# Altium schematic sheet OpenMEA_power.SchDoc
size A4
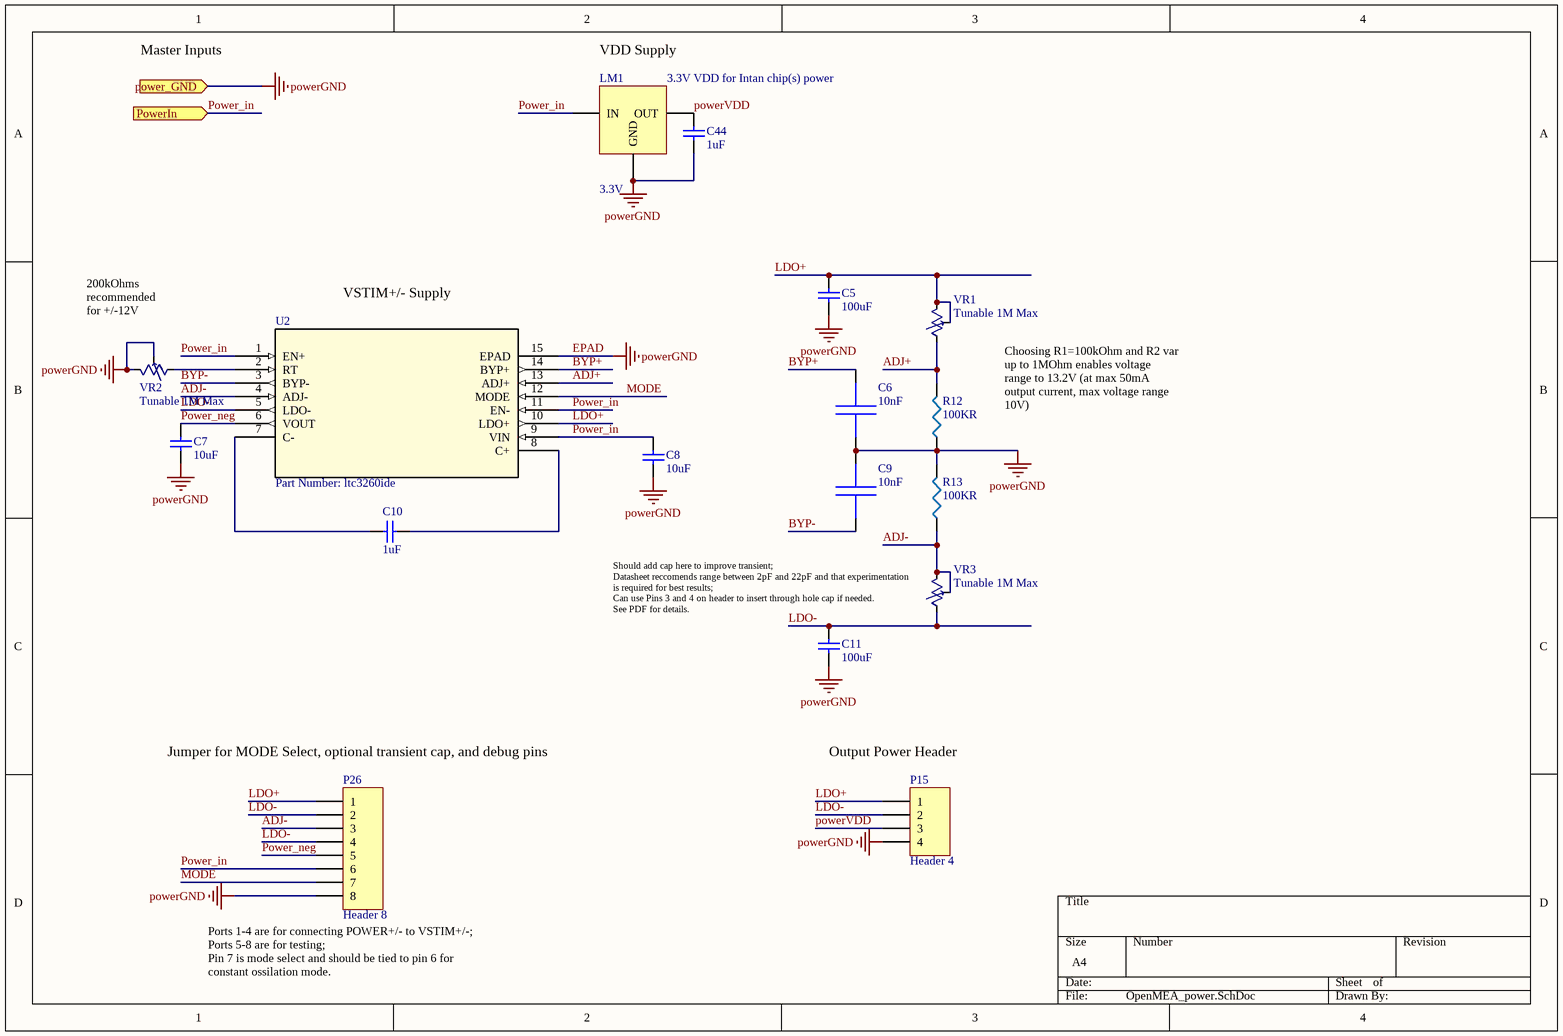
[diagram p0: OpenMEA_power.SchDoc]

## Parts
C5  100uF  [CAP_EEFK_D]
C6  value 10nF  [rcl_0402i_1005m_nominal]  (hidden comment: capacitor_npol_ame)
C7  10uF  [C0805]
C8  10uF  [C0805]
C9  value 10nF  [rcl_0402i_1005m_nominal]  (hidden comment: capacitor_npol_ame)
C10  1uF  [C0805]
C11  100uF  [CAP_EEFK_D]
C44  1uF  [C0805]
LM1  3.3V  [LM1085]
P15  Header 4  [OSTVN04A150]
P26  Header 8  [TE_5-535541-6]
R12  100KR  [R0805]
R13  100KR  [R0805]
U2  Part Number: ltc3260ide  [DFN-14_DE]
VR1  Tunable 1M Max  [res_var_5turn]
VR2  Tunable 1M Max  [res_var_5turn]
VR3  Tunable 1M Max  [res_var_5turn]

## Ports
power_GND (in), PowerIn (in)

## Nets
EPAD: C5.1 C6.1 C7.1 C8.1 C9.1 C11.1 C44.1 LM1.1(GND) P15.4 P26.8 R12.1 R13.2 U2.15(EPAD) VR2.1 VR2.2 ; port power_GND  [also labelled powerGND]
ADJ+: R12.2 U2.13(ADJ+) VR1.3
ADJ-: P26.3 R13.1 U2.4(ADJ-) VR3.1 VR3.2
BYP+: C6.2 U2.14(BYP+)
BYP-: C9.2 U2.3(BYP-)
LDO+: C5.2 P15.1 P26.1 U2.10(LDO+) VR1.1 VR1.2
LDO-: C11.2 P15.2 P26.2 P26.4 U2.5(LDO-) VR3.3
MODE: P26.7 U2.12(MODE)
Power_in: C8.2 LM1.3(IN) P26.6 U2.1(EN+) U2.9(VIN) U2.11(EN-) ; port PowerIn
Power_neg: C7.2 P26.5 U2.6(VOUT)
powerVDD: C44.2 LM1.2(OUT) P15.3
NetC10_1: C10.1 U2.8(C+)
NetC10_2: C10.2 U2.7(C-)
NetU2_2: U2.2(RT) VR2.3

## Notes on the sheet
- Master Inputs
- VDD Supply
- 3.3V VDD for Intan chip(s) power
- VSTIM+/- Supply
- (near VR2) 200kOhms recommended for +/-12V
- Choosing R1=100kOhm and R2 var up to 1MOhm enables voltage range to 13.2V (at max 50mA output current, max voltage range 10V)
- Should add cap here to improve transient;
  Datasheet reccomends range between 2pF and 22pF and that experimentation is required for best results;
  Can use Pins 3 and 4 on header to insert through hole cap if needed.
  See PDF for details.
- (near P26) Jumper for MODE Select, optional transient cap, and debug pins
- (near P15) Output Power Header
- (near P26) Ports 1-4 are for connecting POWER+/- to VSTIM+/-;
  Ports 5-8 are for testing;
  Pin 7 is mode select and should be tied to pin 6 for constant ossilation mode.

## Library data of the parts
C5 C11 = C2012X5R1E106K085AC: CAP ALUM 100UF 20% 35V SMD; Manufacturer: Panasonic Electronic Components; Manufacturer Part Number: EEE-FT1V101AP; Dielectric: Electrolytic Capacitor; Diam.: 6.3mm; Polarization: Polarized; ESR (Equivalent Series Resistance): 260mOhm @ 100kHz; Ripple Current @ Low Frequency: 195mA @ 120Hz; Ripple Current @ High Frequency: 300mA @ 100kHz; Supplier 1: Digi-Key; Stock 1: 336,289; Pricing 1: 1=0.86;  10=0.605;  100=0.3984  (CAD); Mount: Surface Mount; Dielectric Material: N/A; Min Operating Temperature: -55°C; Max Operating Temperature: 105°C; Packaging: Cut Tape (CT); Capacitance: 100uF; Tolerance: 20%; Voltage Rating: 35V; Termination: SMD/SMT; Voltage Rating (DC): 35V; Supplier Part Number 1: PCE5016CT-ND; Supplier Link 1: https://www.digikey.ca/product-detail/en/panasonic-electronic-components/EEE-FT1V101AP/PCE5016CT-ND/2652071; Length: 6.6mm; Width: 6.6mm; Height: 6.1mm; Package Type: Radial Can, SMT; ComponentLink1URL: https://industrial.panasonic.com/cdbs/www-data/pdf/RDE0000/ABA0000C1240.pdf; ComponentLink1Description: Datasheet; ComponentLink2URL: https://industrial.panasonic.com/cdbs/www-data/pdf/RDE0000/DME0000COL90.pdf; ComponentLink2Description: NamingScheme
C6 C9 = capacitor_npol_ame: Capacitor Non-polarized American Symbol; Manufacturer: Murata Electronics North America; Manufacturer Part Number: GRM155R71E103KA01D; Voltage Rating: 25V; Tolerance: 10%; Case Code: 0402; Supplier 1: Digikey; Supplier Part Number 1: 490-1312-1-ND; Supplier Link 1: https://www.digikey.ca/products/en?keywords=490-1312-1-ND; Stock 1: 4961; Pricing 1: 1=0.14;  10=0.042;  100=0.0188;  500=0.01346;  1000=0.01058;  3500=0.00961;  5000=0.00884  (CAD); ComponentLink1URL: https://search.murata.co.jp/Ceramy/image/img/A01X/G101/ENG/GRM155R71E103KA01-01.pdf; ComponentLink1Description: Reference Sheet
C7 C8 = C2012X5R1E106K085AC: CAP 10UF; Manufacturer: Samsung Electro-Mechanics; Manufacturer Part Number: CL21A106KAYNNNE; Dielectric Material: Ceramic; Tolerance: 10%; Voltage Rating: 25V; Dielectric: X5R; Supplier 1: Digi-Key; Stock 1: 843; Pricing 1: 1=0.39;  10=0.264;  100=0.13340;  500=0.09128;  1000=0.08075  (CAD); Mount: Surface Mount; Case/Package: 0805; Case Code (Metric): 2012; Case Code (Imperial): 0805; Min Operating Temperature: -55°C; Max Operating Temperature: 85°C; Packaging: Tape and Reel; Capacitance: 10uF; Termination: SMD/SMT; Voltage Rating (DC): 25V; Length: 0.079inch; Width: 0.049inch; Thickness: 1.25mm; Lead Free: Lead Free; ComponentLink1URL: http://www.samsungsem.com/kr/support/product-search/mlcc/__icsFiles/afieldfile/2018/06/20/CL21A106KAYNNNE.pdf; ComponentLink1Description: Specifications; ComponentLink2URL: https://media.digikey.com/pdf/Data%20Sheets/Samsung%20PDFs/CL21A106KAYNNNE_Char.pdf; ComponentLink2Description: Characteristics; ComponentLink3URL: https://media.digikey.com/pdf/Data%20Sheets/Samsung%20PDFs/CL_Series_MLCC_ds.pdf; ComponentLink3Description: Datasheet; Supplier Part Number 1: 1276-2891-1-ND; Supplier Link 1: https://www.digikey.ca/product-detail/en/samsung-electro-mechanics/CL21A106KAYNNNE/1276-2891-1-ND/3890977
C10 C44 = C2012X5R1E105K125AA: CAP 1UF; Manufacturer: TDK; Dielectric Material: Ceramic; Tolerance: 10%; Voltage Rating: 25V; Dielectric: X5R; Supplier 1: Digi-Key; Manufacturer Part Number: C2012X5R1E105K125AA; Stock 1: 517560; Pricing 1: 1=0.21, 10=0.146, 100=0.0688, 500=0.0482, 1000=0.0399 (USD); Mount: Surface Mount; Case/Package: 0805; Number of Pins: 2; Weight: 0.000194oz; Case Code (Metric): 2012; Case Code (Imperial): 0805; Min Operating Temperature: -55°C; Max Operating Temperature: 85°C; Package Quantity: 2000; Capacitance: 1uF; Packaging: Tape and Reel; Voltage Rating (DC): 25V; Termination: SMD/SMT; Composition: Ceramic; Voltage: 25V; Length: 2mm; Height: 1.25mm; Width: 0.049inch; Thickness: 0.057inch; Depth: 1.25mm; Radiation Hardening: No; REACH SVHC: No SVHC; Lead Free: Lead Free; ComponentLink1URL: https://datasheet.ciiva.com/11787/0900766b80c1bb00-11787608.pdf; ComponentLink1Description: https://datasheet.ciiva.com/11787/0900766b80c1bb00-11787608.pdf; ComponentLink2URL: https://datasheet.ciiva.com/24218/c2012x5r1e105k125aa-264807-24218920.pdf; ComponentLink2Description: https://datasheet.ciiva.com/24218/c2012x5r1e105k125aa-264807-24218920.pdf; ComponentLink3URL: https://datasheet.ciiva.com/16449/e412-c-16449595.pdf; ComponentLink3Description: https://datasheet.ciiva.com/16449/e412-c-16449595.pdf; ComponentLink4URL: https://datasheet.ciiva.com/28602/1744655-28602171.pdf; ComponentLink4Description: https://datasheet.ciiva.com/28602/1744655-28602171.pdf; ComponentLink5URL: https://datasheet.ciiva.com/15192/getdatasheetpartid-726707-15192140.pdf; ComponentLink5Description: https://datasheet.ciiva.com/15192/getdatasheetpartid-726707-15192140.pdf; Supplier Part Number 1: 445-1419-1-ND; Supplier Link 1: https://www.digikey.ca/products/en?keywords=445-1419-1-ND
LM1 = LM1085: LM1085ISX-3.3/NOPB; Manufacturer: TI National Semiconductor; Number of Outputs: 1; Min Input Voltage: 2.6V; Max Input Voltage: 27V; Max Output Current: 3A; Polarity: Positive; Quiescent Current: 10mA; Dropout Voltage: 1.3V; Min Current Limit: 3.2A; Supplier 1: Digi-Key; Manufacturer Part Number: LM1085ISX-3.3/NOPB; Stock 1: 18956; Pricing 1: 1=2.03, 10=1.826, 100=1.4677 (USD); Mount: Surface Mount; Case/Package: TO-263; Number of Pins: 3; Contact Plating: Tin,Matte; Min Operating Temperature: -40°C; Max Operating Temperature: 125°C; Output Voltage: 3.3V; Nominal Output Voltage: 3.3V; Output Current: 3A; Packaging: Tape and Reel; Package Quantity: 500; Number of Regulators: 1; Length: 10.16mm; Height: 4.57mm; Width: 8.64mm; Radiation Hardening: No; REACH SVHC: No SVHC; Lead Free: Contains Lead; ComponentLink1URL: https://datasheet.ciiva.com/15111/getdatasheetpartid-55637-15111252.pdf; ComponentLink1Description: https://datasheet.ciiva.com/15111/getdatasheetpartid-55637-15111252.pdf; ComponentLink2URL: https://datasheet.ciiva.com/26167/lm1085-26167653.pdf; ComponentLink2Description: https://datasheet.ciiva.com/26167/lm1085-26167653.pdf; ComponentLink3URL: https://datasheet.ciiva.com/3223/lm1085-3223480.pdf; ComponentLink3Description: https://datasheet.ciiva.com/3223/lm1085-3223480.pdf; ComponentLink4URL: https://datasheet.ciiva.com/6582/lm1085-6582715.pdf; ComponentLink4Description: https://datasheet.ciiva.com/6582/lm1085-6582715.pdf; ComponentLink5URL: https://datasheet.ciiva.com/34302/1278979-34302139.pdf; ComponentLink5Description: https://datasheet.ciiva.com/34302/1278979-34302139.pdf; ComponentLink6URL: https://datasheet.ciiva.com/6582/lm1085-6582716.pdf; ComponentLink6Description: https://datasheet.ciiva.com/6582/lm1085-6582716.pdf; ComponentLink7URL: https://datasheet.ciiva.com/6582/lm1085-6582718.pdf; ComponentLink7Description: https://datasheet.ciiva.com/6582/lm1085-6582718.pdf; ComponentLink8URL: https://datasheet.ciiva.com/41457/001013599-da-01-en-ic-reg-l-lm1085isx-3-3-nopb-to-263-3-tid-41457356.pdf; ComponentLink8Description: https://datasheet.ciiva.com/41457/001013599-da-01-en-ic-reg-l-lm1085isx-3-3-nopb-to-263-3-tid-41457356.pdf; Supplier Part Number 1: LM1085ISX-3.3/NOPBCT-ND; Supplier Link 1: https://www.digikey.ca/products/en?keywords=LM1085ISX-3.3%2FNOPBCT-ND
P15 = Header 4: Header, 4-Pin; Manufacturer: On Shore Technology Inc.; Detailed Description: 4 Position Wire to Board Terminal Block Horizontal with Board 0.100" (2.54mm) Through Hole; Pitch (imperial): 100mil; LatestRevisionDate: 17-Jul-2002; LatestRevisionNote: Re-released for DXP Platform.; Publisher: Altium Limited; Manufacturer Part Number: OSTVN04A150; Manufacturer Link: https://www.on-shore.com/part/ostvnxxa150-terminal-block-one-piece-rising-clamp/; Supplier 1: Digikey; Supplier Link 1: https://www.digikey.com/product-detail/en/on-shore-technology-inc/OSTVN04A150/ED10563-ND/1588864; Supplier Part Number 1: ED10563-ND; Pricing 1: 1  1.38000  $1.38  10  0.96900  $9.69  25  0.90400  $22.60  50  0.82040  $41.02  100  0.81680  $81.68  250  0.68972  $172.43  500  0.65340  $326.70  1,000  0.58080  $580.80  5,000  0.47190  $2,359.50 (CAD); Stock 1: 8,195; ComponentLink1URL: http://www.on-shore.com/wp-content/uploads/OSTVNXXA150.pdf; ComponentLink1Description: Datasheet
P26 = Header 8: Header, 8-Pin; Manufacturer: TE Connectivity AMP Connectors; Manufacturer Part Number: 5-535541-6; Manufacturer Link: https://www.te.com/usa-en/product-5-535541-6.html; Supplier 1: Digikey; Supplier Link 1: https://www.digikey.ca/product-detail/en/te-connectivity-amp-connectors/5-535541-6/A32921-ND/1092992; Supplier Part Number 1: A32921-ND; Stock1: 2,929; Price1: 1  2.79000  $2.79  28  2.37000  $66.36  112  2.16411  $242.38  504  1.80345  $908.94  1,008  1.54581  $1,558.18  5,012  1.37062  $6,869.56  10,024  1.33971  (CAD); ComponentLink1URL: https://www.te.com/commerce/DocumentDelivery/DDEController?Action=srchrtrv&DocNm=535541&DocType=Customer+Drawing&DocLang=English; ComponentLink1Description: Datasheet
R12 R13 = RES100: CRCW0805100KFKEA; Manufacturer: Vishay Dale; Tolerance: 1%; Temperature Coefficient: 100ppm/°C; Power Rating: 125mW; Voltage Rating: 200V; Supplier 1: 7PCB/Bittele; Manufacturer Part Number: CRCW0805100KFKEA; Stock 1: 286355; Pricing 1: Free with 7PCB; Case/Package: 0805; Case Code (Metric): 2012; Case Code (Imperial): 0805; Min Operating Temperature: -55°C; Max Operating Temperature: 155°C; Resistance: 100KR; Packaging: Cut Tape (CT); Composition: Thick Film; Package Quantity: 1; Number of Terminations: 2; Termination: SMD/SMT; Military Standard: Not; Max Power Dissipation: 125mW; REACH SVHC: Unknown; Lead Free: Lead Free; ComponentLink1URL: http://www.vishay.com/docs/20035/dcrcwe3.pdf; ComponentLink1Description: Datasheet; Supplier Part Number 1: CRCW0805100KFKEA; Weight: 4mg; Length: 2mm; Width: 1.25mm; Supplier Link 1: https://parts.7pcb.com/; Supplier2: Digikey; SupplierLink2: https://www.digikey.ca/product-detail/en/vishay-dale/CRCW0805100KFKEA/541-100KCCT-ND/1181013; Supplier Part Number 2: 541-100KCCT-ND; Stock2: 286,105; Pricing 2: 1=0.15; (CAD)
U2 = LTC3260IDE: IC REG CHARGE PUMP INV 14DFN; Manufacturer: Linear Technology/Analog Devices; Manufacturer Part Number: LTC3260EDE#TRPBF; Vendor: Linear Technology; Detailed Description: Charge Pump Switching Regulator IC Positive and Negative (Dual Rail) Fixed -Vin 2 Output 100mA 14-WFDFN Exposed Pad; Pricing1: Price Break  Unit Price  Extended Price  1  13.01000  $13.01  25  9.55440  $238.86  100  7.14360  $714.36  250  6.78644  $1,696.61  500  6.63338  $3,316.69 (CAD); Voltage - Input (Min): 4.5V; Voltage - Input (Max): 32V; Current - Output: 100mA; Frequency - Switching: 50kHz ~ 500kHz; Synchronous Rectifier: No; Output Configuration: Positive and Negative (Dual Rail); Manufacturer_Part_Number: ltc3260ide; Copyright: Copyright (C) 2018 Accelerated Designs. All rights reserved; RefDes: RefDes; Type: DEV; Value: Value; Supplier 1: Digikey; Supplier Part Number 1: LTC3260EDE#TRPBFCT-ND; Supplier Link 1: https://www.digikey.ca/product-detail/en/linear-technology-analog-devices/LTC3260EDE-TRPBF/LTC3260EDE-TRPBFCT-ND/8433300; Stock1: 4,881; ComponentLink1URL: http://www.linear.com/docs/41410; ComponentLink1Description: Datasheet; Operating Temperature: -40°C ~ 125°C (TJ); Package / Case: 14-WFDFN Exposed Pad; Supplier Device Package: 14-DFN (4x3); Mounting Type: Surface Mount; Packaging: Cut Tape (CT)
VR1-VR3 = RES_VAR_5TURN: TRIMMER 1M OHM 0.25W J LEAD TOP; Manufacturer: Nidec Copal; Manufacturer Part Number: SM-42TW105; Resistance: 1MOhms; Tolerance: 10%; Number of Turns: 11; Max Power Dissipation: 250mW; Temperature Coefficient: 100ppm/°C; Supplier 1: Digi-Key; Stock 1: 347; Pricing 1: 1=5.26;  10=4.604;  25=4.1112 ... (CAD); Mount: Surface Mount; Min Operating Temperature: -65°C; Max Operating Temperature: 150°C; Package Quantity: 1; Packaging: Cut Tape; Composition: Cermet; Length: 0.189inch; Height: 0.201inch; Width: 0.138inch; Radiation Hardening: No; ComponentLink1Description: https://www.nidec-copal-electronics.com/e/catalog/trimmer/sm-42&sm-43.pdf; Supplier Part Number 1: SM-42TW105CT-ND; Supplier Link 1: https://www.digikey.ca/product-detail/en/nidec-copal-electronics/SM-42TW105/SM-42TW105CT-ND/1632404